# EAGLE schematic Control Board (EAGLE 6.2)
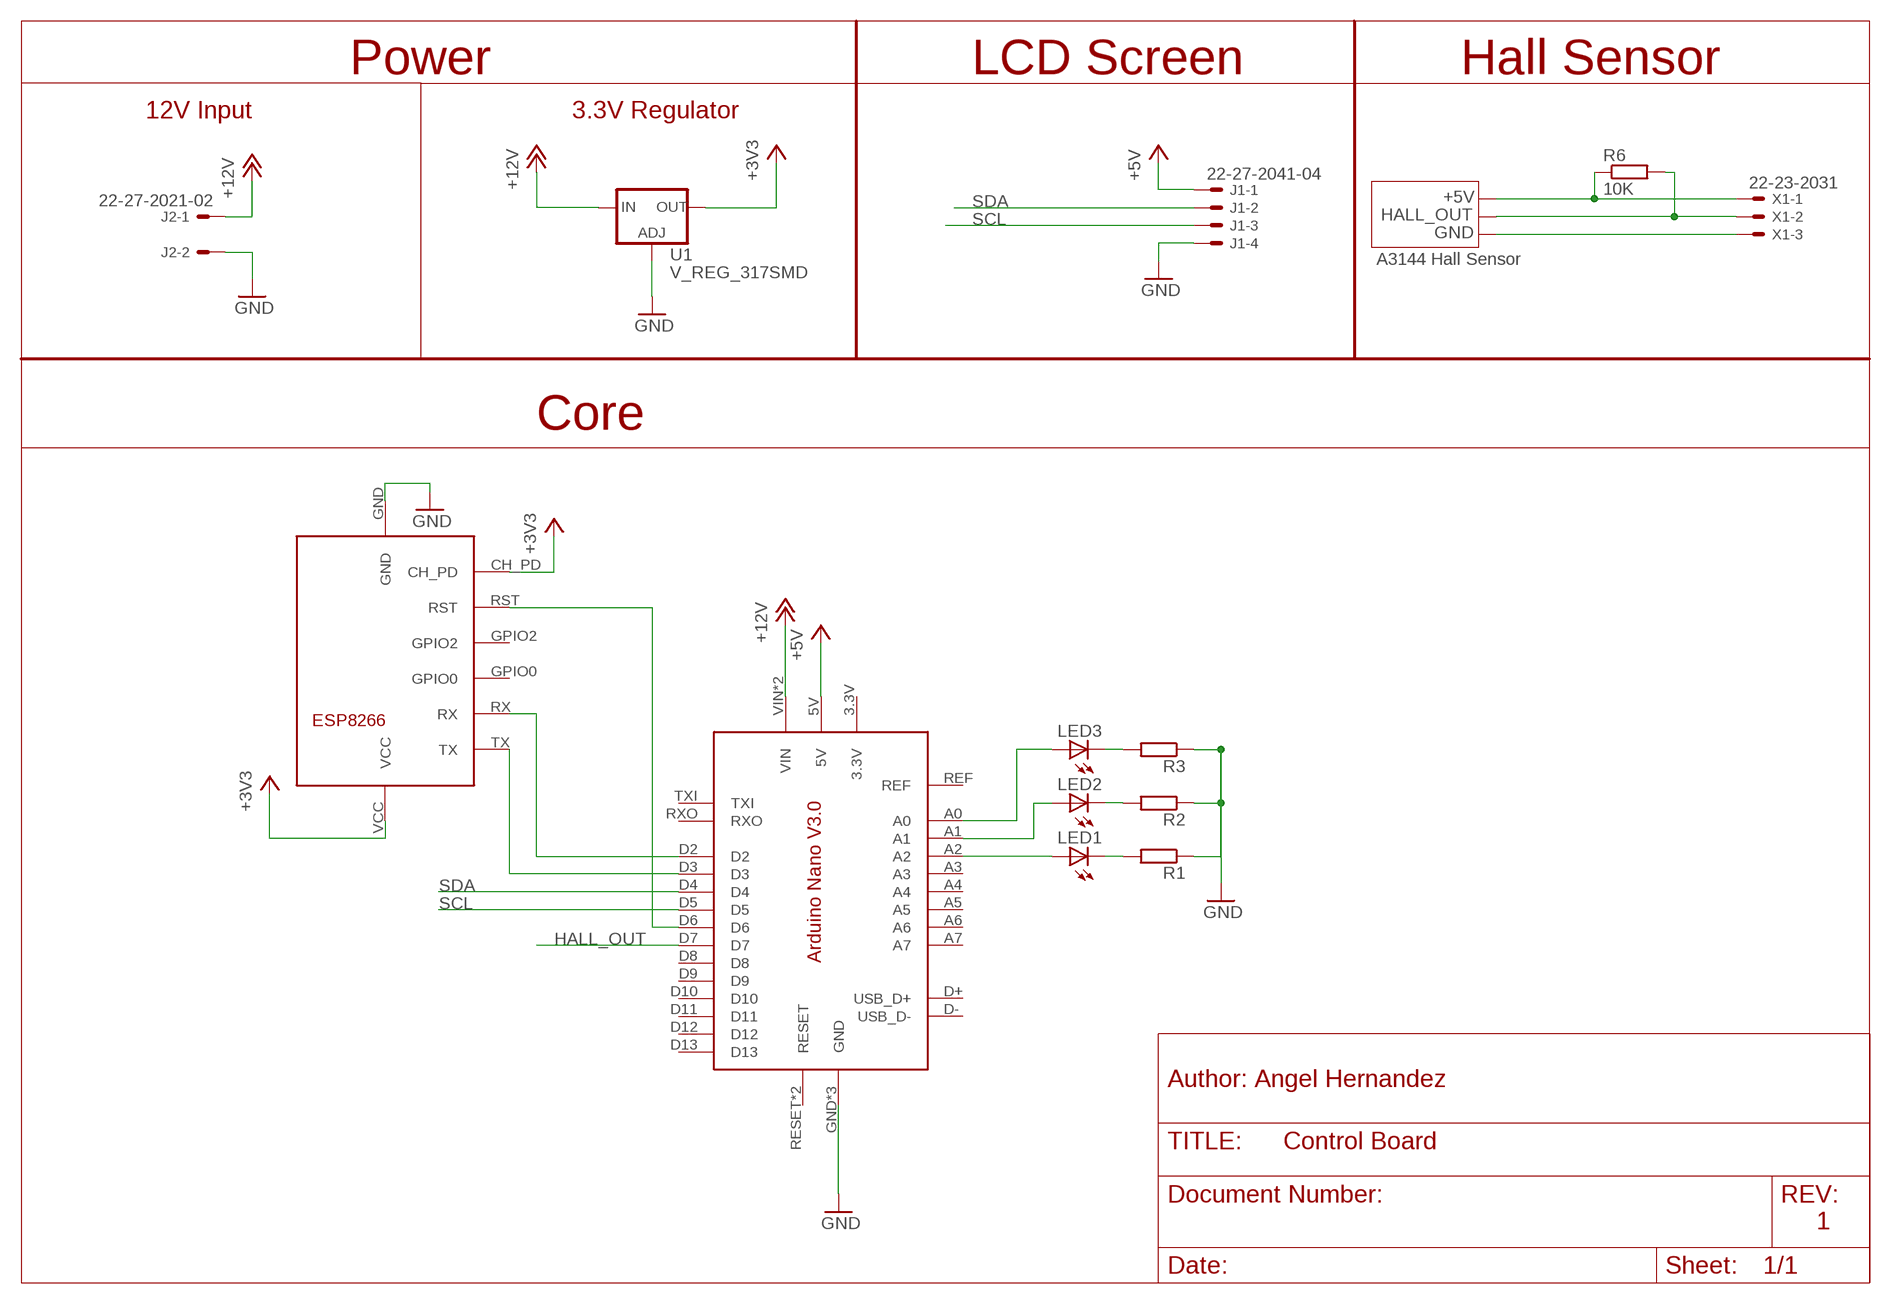
[diagram p0: schematic, sheet 1]

## Parts
J1  22-27-2041-04  [6410-04]
J2  22-27-2021-02  [6410-02]
LED1  LED5MM  [LED5MM]
LED2  LED5MM  [LED5MM]
LED3  LED5MM  [LED5MM]
R1  R-EU_0204/2V  [0204V]
R2  R-EU_0204/2V  [0204V]
R3  R-EU_0204/2V  [0204V]
R6  10K  R-EU_0204/7  [0204/7]
U1  V_REG_317SMD  [SOT223]
U$1  ARDUINO_NANO_V3  [ARDUINO_NANO_V3]
U$2  ESP8266  [ESP8266]
X1  22-23-2031  [22-23-2031]

## Nets
+3V3: U1.2(OUT) U$2.CH_PD U$2.VCC
+5V: J1.1 R6.1 U$1.5V X1.1
+12V: J2.1 U1.3(IN) U$1.VIN U$1.VUSB(VIN)
GND: J1.4 J2.2 R1.1 R2.1 R3.1 U1.1(ADJ) U$1.GND U$1.GND1(GND) U$1.GND_USB(GND) U$2.GND X1.3
HALL_OUT: R6.2 U$1.D7 X1.2
N$1: LED1.A U$1.A2
N$2: U$1.D3 U$2.TX
N$3: U$1.D2 U$2.RX
N$4: LED2.A U$1.A1
N$5: LED3.A U$1.A0
N$6: LED1.K(C) R1.2
N$7: LED2.K(C) R2.2
N$8: LED3.K(C) R3.2
N$10: U$1.D6 U$2.RST
SCL: J1.3 U$1.D5
SDA: J1.2 U$1.D4
Unconnected: U$1.3.3V U$1.A3 U$1.A4 U$1.A5 U$1.A6 U$1.A7 U$1.D8 U$1.D9 U$1.D10 U$1.D11 U$1.D12 U$1.D13 U$1.D+(USB_D+) U$1.D-(USB_D-) U$1.REF U$1.RESET U$1.RESET1(RESET) U$1.RXO U$1.TXI U$2.GPIO0 U$2.GPIO2

## Notes on the sheet
- Power | LCD Screen | Hall Sensor
- 12V Input | 3.3V Regulator
- A3144 Hall Sensor
- Core
- Author: Angel Hernandez
- 1

## Library data of the parts
J1 = con-molex:22-?-04: CONNECTOR wire to board 2.54 mm (.1 inch) pitch header; OC_FARNELL: unknown; OC_NEWARK: unknown
J2 = con-molex:22-?-02: CONNECTOR wire to board 2.54 mm (.1 inch) pitch header; OC_FARNELL: unknown; OC_NEWARK: unknown
LED1-LED3 = led:LED: LED OSRAM: - CHIPLED LG R971, LG N971, LY N971, LG Q971, LY Q971, LO R971, LY R971 LH N974, LH R974 LS Q976, LO Q976, LY Q976 LO Q996 - Hyper CHIPLED LW Q18S LB Q993, LB Q99A, LB R99A - SideLED LS A670, LO A670, LY A670, LG A670, LP A670 LB A673, LV A673, LT A673, LW A673 LH A674 LY A675 LS A676, LA A676, LO A676, LY A676, LW A676 LS A679, LY A679, LG A679 - Hyper Micro SIDELED® LS Y876, LA Y876, LO Y876, LY Y876 LT Y87S - SmartLED LW L88C, LW L88S LB L89C, LB L89S, LG L890 LS L89K, LO L89K, LY L89K LS L896, LA L896, LO L896, LY L896 - TOPLED LS T670, LO T670, LY T670, LG T670, LP T670 LSG T670, LSP T670, LSY T670, LOP T670, LYG T670 LG T671, LOG T671, LSG T671 LB T673, LV T673, LT T673, LW T673 LH T674 LS T676, LA T676, LO T676, LY T676, LB T676, LH T676, LSB T676, LW T676 LB T67C, LV T67C, LT T67C, LS T67K, LO T67K, LY T67K, LW E67C LS E67B, LA E67B, LO E67B, LY E67B, LB E67C, LV E67C, LT E67C LW T67C LS T679, LY T679, LG T679 LS T770, LO T770, LY T770, LG T770, LP T770 LB T773, LV T773, LT T773, LW T773 LH T774 LS E675, LA E675, LY E675, LS T675 LS T776, LA T776, LO T776, LY T776, LB T776 LHGB T686 LT T68C, LB T68C - Hyper Mini TOPLED® LB M676 - Mini TOPLED Santana® LG M470 LS M47K, LO M47K, LY M47K Source: http://www.osram.convergy.de LUXEON: - LUMILED® LXK2-PW12-R00, LXK2-PW12-S00, LXK2-PW14-U00, LXK2-PW14-V00 LXK2-PM12-R00, LXK2-PM12-S00, LXK2-PM14-U00 LXK2-PE12-Q00, LXK2-PE12-R00, LXK2-PE12-S00, LXK2-PE14-T00, LXK2-PE14-U00 LXK2-PB12-K00, LXK2-PB12-L00, LXK2-PB12-M00, LXK2-PB14-N00, LXK2-PB14-P00, LXK2-PB14-Q00 LXK2-PR12-L00, LXK2-PR12-M00, LXK2-PR14-Q00, LXK2-PR14-R00 LXK2-PD12-Q00, LXK2-PD12-R00, LXK2-PD12-S00 LXK2-PH12-R00, LXK2-PH12-S00 LXK2-PL12-P00, LXK2-PL12-Q00, LXK2-PL12-R00 Source: www.luxeon.com KINGBRIGHT: KA-3528ASYC Source: www.kingbright.com
R1-R3 = rcl:R-EU_: RESISTOR, European symbol
R6 = resistor:R-EU_: RESISTOR, European symbol
U1 = SparkFun-PowerIC:V_REG_317: Voltage Regulator Standard LM317 adjustable voltage regulator. AOI (Adjust Output Input). Google 'LM317 Calculator' for easy to use app to get the two resistor values needed. 240/720 for 5V output. 240/390 for 3.3V output. Spark Fun Electronics SKU : COM-00527
U$1 = MimaZ:ARDUINO_NANO_V3
U$2 = MimaZ:ESP8266
X1 = con-molex:22-23-2031: .100" (2.54mm) Center Header - 3 Pin; MF: MOLEX; MPN: 22-23-2031; OC_FARNELL: 1462950; OC_NEWARK: 30C0862